# Altium schematic sheet XMOD.SchDoc
size A4; SheetNumber: 2; SheetTotal: 24; Website: www.ultrazohm.com
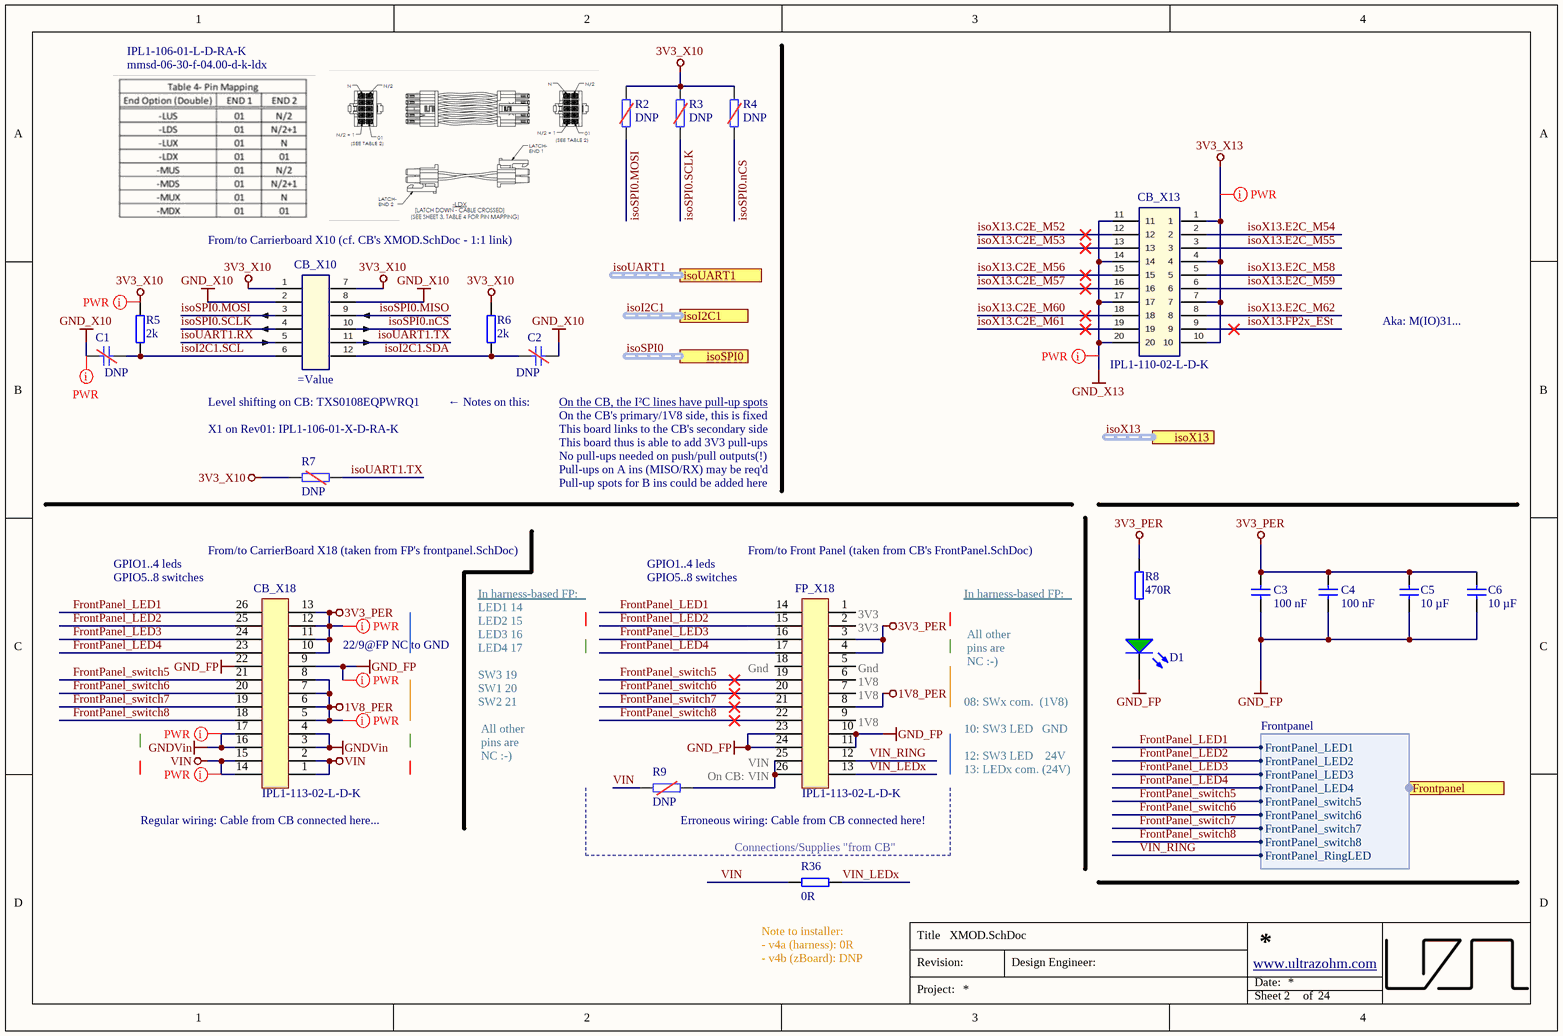
[diagram p0: XMOD.SchDoc]

## Parts
C1  DNP  [C_0603_TE-DNP]  (no BOM)
C2  DNP  [C_0603_TE-DNP]  (no BOM)
C3  100 nF  [C_0603_TE]
C4  100 nF  [C_0603_TE]
C5  10 µF  [C_1206_TE]
C6  10 µF  [C_1206_TE]
CB_X10  (no value)  [IPL1-106-02-L-D-K]
CB_X13  IPL1-110-02-L-D-K  [IPL1-110-02-L-D-K]
CB_X18  IPL1-113-02-L-D-K  [IPL1-113-02-L-D-K]
D1  LED Green  [WL-SMCW_0603]  (value not drawn)
FP_X18  IPL1-113-02-L-D-K  [IPL1-113-02-L-D-K]
R2  DNP  [R_0603_TE-DNP]  (no BOM)
R3  DNP  [R_0603_TE-DNP]  (no BOM)
R4  DNP  [R_0603_TE-DNP]  (no BOM)
R5  2k  [R_0603_TE]
R6  2k  [R_0603_TE]
R7  DNP  [R_0603_TE-DNP]  (no BOM)
R8  470R  [R_0603_TE]
R9  DNP  [R_0603_TE-DNP]  (no BOM)
R36  0R  [R_0603_TE]

## Ports
Frontpanel (harness Frontpanel), isoI2C1 (harness I2C), isoSPI0 (harness SPI0), isoUART1 (harness UART), isoX13 (harness X13)

## Harnesses
Frontpanel: FrontPanel_LED1, FrontPanel_LED2, FrontPanel_LED3, FrontPanel_LED4, FrontPanel_switch5, FrontPanel_switch6, FrontPanel_switch7, FrontPanel_switch8, FrontPanel_RingLED

## Nets
1V8_PER: CB_X18.5 CB_X18.6 CB_X18.7 CB_X18.8 FP_X18.8
3V3_PER: C3.1 C4.1 C5.2 C6.2 CB_X18.10 CB_X18.11 CB_X18.12 CB_X18.13 FP_X18.3 FP_X18.4 R8.2
3V3_X10: CB_X10.1 CB_X10.7 R2.2 R3.2 R4.2 R5.2 R6.2 R7.2
3V3_X13: CB_X13.1 CB_X13.4 CB_X13.7 CB_X13.10
GND_FP: C3.2 C4.2 C5.1 C6.1 CB_X18.9 CB_X18.22 D1.1(K) FP_X18.10 FP_X18.11 FP_X18.23 FP_X18.24
GND_X10: C1.1 C2.2 CB_X10.2 CB_X10.8
GND_X13: CB_X13.11 CB_X13.14 CB_X13.17 CB_X13.20
GNDVin: CB_X18.3 CB_X18.4 CB_X18.16 CB_X18.17
VIN: CB_X18.1 CB_X18.2 CB_X18.14 CB_X18.15 R9.1 R36.1
FrontPanel_LED1: CB_X18.26 FP_X18.14 ; port Frontpanel.FrontPanel_LED1
FrontPanel_LED2: CB_X18.25 FP_X18.15 ; port Frontpanel.FrontPanel_LED2
FrontPanel_LED3: CB_X18.24 FP_X18.16 ; port Frontpanel.FrontPanel_LED3
FrontPanel_LED4: CB_X18.23 FP_X18.17 ; port Frontpanel.FrontPanel_LED4
FrontPanel_switch5: CB_X18.21 FP_X18.19 ; port Frontpanel.FrontPanel_switch5
FrontPanel_switch6: CB_X18.20 FP_X18.20 ; port Frontpanel.FrontPanel_switch6
FrontPanel_switch7: CB_X18.19 FP_X18.21 ; port Frontpanel.FrontPanel_switch7
FrontPanel_switch8: CB_X18.18 FP_X18.22 ; port Frontpanel.FrontPanel_switch8
isoI2C1.SCL: C1.2 CB_X10.6 R5.1
isoI2C1.SDA: C2.1 CB_X10.12 R6.1
isoSPI0.MISO: CB_X10.9
isoSPI0.MOSI: CB_X10.3 R2.1
isoSPI0.nCS: CB_X10.10 R4.1
isoSPI0.SCLK: CB_X10.4 R3.1
isoUART1.RX: CB_X10.5
isoUART1.TX: CB_X10.11 R7.1
isoX13.C2E_M52: CB_X13.12
isoX13.C2E_M53: CB_X13.13
isoX13.C2E_M56: CB_X13.15
isoX13.C2E_M57: CB_X13.16
isoX13.C2E_M60: CB_X13.18
isoX13.C2E_M61: CB_X13.19
isoX13.E2C_M54: CB_X13.2
isoX13.E2C_M55: CB_X13.3
isoX13.E2C_M58: CB_X13.5
isoX13.E2C_M59: CB_X13.6
isoX13.E2C_M62: CB_X13.8
isoX13.FP2x_ESt: CB_X13.9
VIN_LEDx: FP_X18.13 R36.2
VIN_RING: FP_X18.12 ; port Frontpanel.FrontPanel_RingLED
NetD1_2: D1.2(A) R8.1
NetFP_X18_25: FP_X18.25 FP_X18.26 R9.2

Not connected (* = marked no-connect by the designer): FP_X18 1 2 5 6 7 9 18

## Buses and harness runs
harness isoI2C1 = port isoI2C1
harness isoSPI0 = port isoSPI0
harness isoUART1 = port isoUART1
harness isoX13 = port isoX13

## Layout directives
net class PWR: 1V8_PER, 3V3_PER, 3V3_X10, 3V3_X13, GND_FP, GND_X10, GND_X13, GNDVin, VIN

## Notes on the sheet
- IPL1-106-01-L-D-RA-K
- mmsd-06-30-f-04.00-d-k-ldx
- (near CB_X10) From/to Carrierboard X10 (cf. CB's XMOD.SchDoc - 1:1 link)
- Aka: M(IO)31...
- (near CB_X10) Level shifting on CB: TXS0108EQPWRQ1
- (near R7) X1 on Rev01: IPL1-106-01-X-D-RA-K
- ← Notes on this:
- (near C2) On the CB, the I²C lines have pull-up spots <https://bitbucket.org/ultrazohm/uz_carrierboard/issues/126/#comment-66924528>
- On the CB's primary/1V8 side, this is fixed
- This board links to the CB's secondary side
- This board thus is able to add 3V3 pull-ups
- No pull-ups needed on push/pull outputs(!)
- Pull-ups on A ins (MISO/RX) may be req'd
- Pull-up spots for B ins could be added here
- (near CB_X18) GPIO5..8 switches
- GPIO1..4 leds
- From/to CarrierBoard X18 (taken from FP's frontpanel.SchDoc)
- GPIO5..8 switches
- From/to Front Panel (taken from CB's FrontPanel.SchDoc)
- 22/9@FP NC to GND
- In harness-based FP:
  LED1	14
  LED2	15
  LED3	16
  LED4	17
  SW3	19
  SW1	20
  SW2	21
  All other
  pins are
  NC :-)
- (near R9) On CB:
- (near FP_X18) Gnd
  VIN
  VIN
- (near FP_X18) 3V3
  3V3
  Gnd
  1V8
  1V8
  1V8
- In harness-based FP:
  All other
  pins are
  NC :-)
  08: SWx com.  (1V8)
  10: SW3 LED   GND
  12: SW3 LED    24V
  13: LEDx com. (24V)
- (near CB_X18) Regular wiring: Cable from CB connected here...
- Erroneous wiring: Cable from CB connected here!
- (near R36) Connections/Supplies "from CB"
- (near R36) Note to installer:
  - v4a (harness): 0R
  - v4b (zBoard): DNP
- Title
- Revision:
- Design Engineer:
- Date:
- Project:
- Sheet
- of

## Library data of the parts
C1 C2 = UZgen_C_0603_DNP: Generic capacitor (DNP); Manufacturer: UZgen; Created from: UZgenTool; Manufacturer Part Number: UZgen_C_0603_DNP; PartID: 5812; Created On: 29/03/2025 17:15:00; Value: DNP; Device Package: 0603; Voltage: -; Technology: -; Tolerance: -; Mounting Type: SMD; Last Updated: 02/04/2025 19:05:00
C3 C4 = UZgen_C_0603_100nF_50V_X7R: Generic capacitor; Manufacturer: UZgen; Tolerance: 10 %; Voltage: 50V; Created from: AGeiger; Technology: X7R; Value: 100 nF; Manufacturer Part Number: UZgen_C_0603_100nF_50V_X7R; PartID: 1; Created On: 02/07/2024 14:42:23; Device Package: 0603; Mounting Type: SMD; Last Updated: 08/08/2024 15:01:15
C5 C6 = UZgen_C_1206_10uF_50V_X7R: Generic capacitor; Manufacturer: UZgen; Tolerance: 10 %; Voltage: 50V; Created from: MGeier; Value: 10 µF; Manufacturer Part Number: UZgen_C_1206_10uF_50V_X7R; PartID: 5807; Created On: 20/03/2025 14:05:00; Device Package: 1206; Technology: X7R; Mounting Type: SMD; Last Updated: 20/03/2025 14:05:00
CB_X10 = IPL1-106-02-L-D-K: Headers & Wire Housings .100" Mini Mate Isolated Power Terminal Header; Manufacturer: SAMTEC; Created from: AGeiger; Value: IPL1-106-02-L-D-K; Manufacturer Part Number: IPL1-106-02-L-D-K; PartID: 29; Created On: 08/04/2024 08:26:00; ComponentLink1Description: Datasheet; ComponentLink1URL: https://www.mouser.de/datasheet/2/527/ipl1-2854487.pdf; Last Updated: 30/04/2024 09:35:24; Mounting Type: SMD; Operating Temperature: -55 °C to +125 °C; Series: IPL1; Supplier 1: Mouser; Supplier Part Number 1: 200-IPL110602LDK; Supplier 2: LCSC; Supplier Part Number 2: C3032298; LCSC Part Number: C3032298
CB_X13 = IPL1-110-02-L-D-K: 2.54 mm Double Row Termin Assembly (SMD); Manufacturer: SAMTEC; Created from: MGremer; Number of positions: 10; Manufacturer Part Number: IPL1-110-02-L-D-K; PartID: 21; Created On: 30/11/2020 10:38:50; ComponentLink1Description: Homepage; ComponentLink1URL: https://www.samtec.com/products/ipl1; Component Type: Samtec Connector; Device Package: Connector; Last Updated: 01/04/2025 14:15:00; Mounting Type: THT; Supplier 1: SAMTEC; Supplier Part Number 1: IPL1-110-02-L-D-K; Supplier 2: Digi-Key; Supplier Part Number 2: SAM10586-ND; Supplier 3: LCSC; Supplier Part Number 3: C7544188; Type: Connector; Live Cycle Status: 1; Number of rows: 2; Stock number: not stored; LCSC Part Number: C7544188
CB_X18 FP_X18 = IPL1-113-02-L-D-K: 2.54 mm Double Row Termin Assembly (SMD); Manufacturer: SAMTEC; AN: 30828; Mixed: SMT; Temperature-Range: -55/+125; Extra: Connector Header IPL1, 2-row 26pos, key polarization, SMT 0°; Created from: MGremer; Number of positions: 13; Case: IPL1; HelpURL: b:\AD\adlib\datasheet\Samtec\IPL1-SMT\; H-ART: IPL1-113-02-L-D-K; Manufacturer Part Number: IPL1-113-02-L-D-K; PartID: 51; Created On: 30/11/2020 10:38:50; ComponentLink1Description: Homepage; ComponentLink1URL: https://www.samtec.com/products/ipl1; Component Type: Samtec Connector; Device Package: Connector; Last Updated: 25/01/2024 19:16:44; Mounting Type: SMD; Supplier 1: SAMTEC; Supplier Part Number 1: IPL1-113-02-L-D-K; Type: Connector; Live Cycle Status: 1; Number of rows: 2; LCSC Part Number: C5290052; Stock number: not stored
D1 = UZgen_LED_0603_Green: Standard LEDs - SMD 0603 green; Manufacturer: UZgen; Created from: UZgenTool; ComponentLink1Description: N/A; ComponentLink1URL: N/A; Value: LED Green; Supplier 1: LCSC; Supplier Part Number 1: =LCSC Part Number; Manufacturer Part Number: UZgen_LED_0603_Green; PartID: 21; Created On: 09/09/2024 10:45:01; Component Type: LED Diode; Device Package: 0603; Last Updated: 09/09/2024 10:45:01; Mounting Type: SMD; Type: Standard; Live Cycle Status: 1; Stock number: not stored; Color: green
R2-R4 R7 R9 = UZgen_R_0603_DNP: Generic resistor (DNP); Manufacturer: UZgen; Created from: UZgenTool; Manufacturer Part Number: UZgen_R_0603_DNP; PartID: 593; Created On: 25/03/2025 14:26:15; Value: DNP; Device Package: 0603; Tolerance: -; Mounting Type: SMD; Last Updated: 02/04/2025 19:05:00
R5 R6 = UZgen_R_0603_2k: Generic resistor; Manufacturer: UZgen; Tolerance: 1 %; Created from: UZgenTool; Value: 2k; Manufacturer Part Number: UZgen_R_0603_2k; PartID: 228; Created On: 02/07/2024 17:29:49; Device Package: 0603; Mounting Type: SMD; Last Updated: 02/07/2024 17:29:49
R8 = UZgen_R_0603_470R: Generic resistor; Manufacturer: UZgen; Tolerance: 1 %; Created from: UZgenTool; Value: 470R; Manufacturer Part Number: UZgen_R_0603_470R; PartID: 213; Created On: 02/07/2024 17:29:49; Device Package: 0603; Mounting Type: SMD; Last Updated: 02/07/2024 17:29:49
R36 = UZgen_R_0603_0R: Generic resistor; Manufacturer: UZgen; Tolerance: 1 %; Created from: UZgenTool; Value: 0R; Manufacturer Part Number: UZgen_R_0603_0R; PartID: 581; Created On: 08/07/2024 14:34:30; Device Package: 0603; Mounting Type: SMD; Last Updated: 08/07/2024 14:34:30